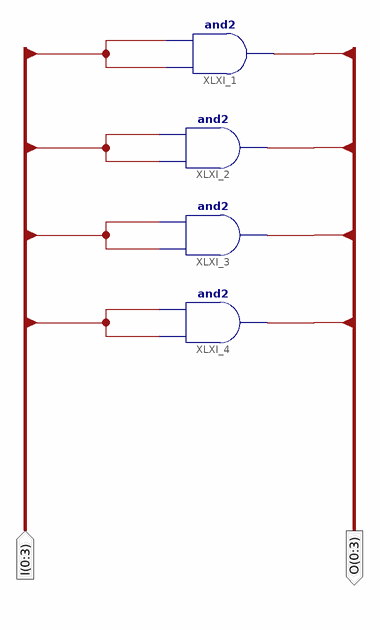
[diagram p0: schematic sheet 1]
// Xilinx ISE schematic Bit4Connector.sch (spartan3e) as structural Verilog: 4 symbols, 2 ports
module Bit4Connector (
  input  [0:3] I,
  output [0:3] O
);

  and XLXI_1 (O[0], I[0], I[0]);
  and XLXI_2 (O[1], I[1], I[1]);
  and XLXI_3 (O[2], I[2], I[2]);
  and XLXI_4 (O[3], I[3], I[3]);
endmodule
